# Altium project Modulo RF MK1.PrjPcb (part 1 of 2)
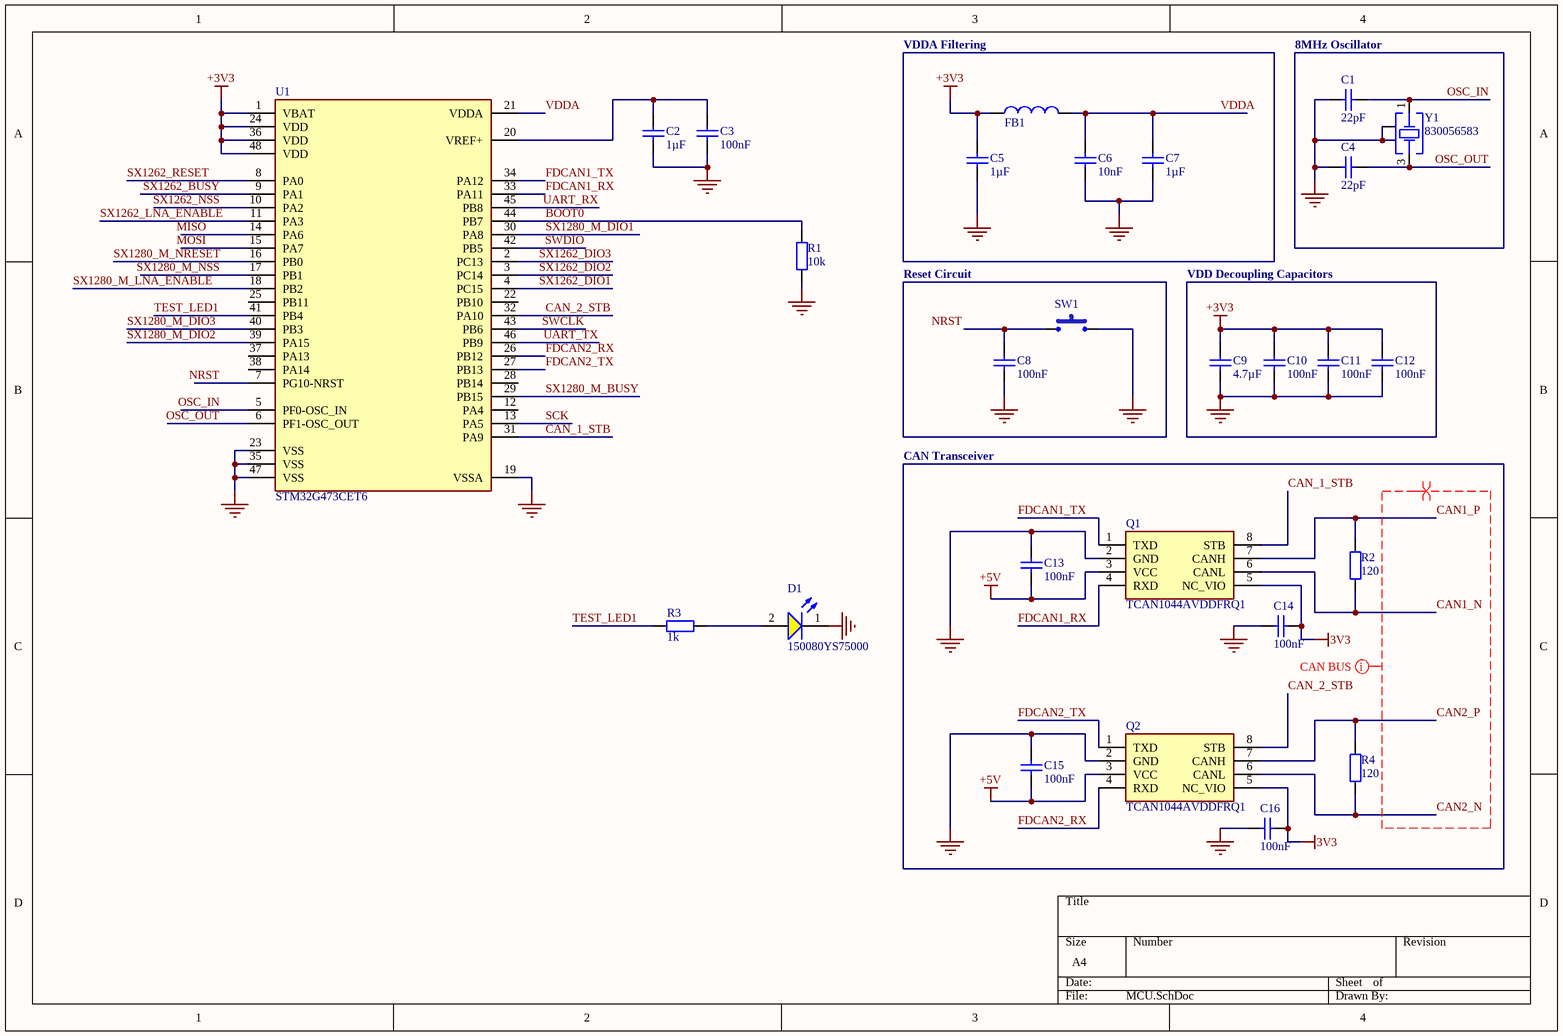
[diagram p0: MCU.SchDoc]
5 sheets, 138 parts. Net scope: global (net labels, ports and power ports of the same name join across sheets).
Board file: PCB_RF.PcbDoc
Sheets:
  MCU.SchDoc
  Connectors.SchDoc
  SX1280 MID VELOCITY.SchDoc
  SX1262.SchDoc
  Current and Voltage Measurement.SchDoc

## Sheet MCU.SchDoc
size A4; SheetNumber: 1; SheetTotal: 5; SPICEModelCacheSJGRFUCR: <root> / <DocumentId>SJGRFUCR</DocumentId> / <CacheFrame Number="0"> / <Model Name="0603_885012206071_100nf" Kind="CKT"> / <Text>******* / .subckt 0603_885012206071_100nF 1 2 / Rser 1 3 0.025 / Lser 2 4 0.0000000008 / C1 3 4 0.0000001 / Rpar 3 4 5000000000 / .ends 0603_885012206071_100nF</Text> / </Model> / <Model Name="0805_150080ys75000" Kind="CKT"> / <Text>****** / .subckt 0805_150080YS75000  1  2 / D1 1 2 SMCW / .MODEL SMCW D / + IS=10.000E-21 / + N=1.8000 / + RS=1.0003E-6 / + IKF=1.8092E-3 / + CJO=1.0000E-12 / + M=.3333 / + VJ=.75 / + BV=5 / + IBV=10.00E-6 / + TT=5.0000E-9 / .ends</Text> / </Model> / </CacheFrame> / </root>

### Parts
C1  value 22pF  [WCAP-CSGP_0603_L1.6W0.8H0.8_Reflow]  (hidden comment: 885012006034)
C2  value 1µF  [WCAP-CSGP_0603_L1.6W0.8H0.8_Reflow]  (hidden comment: 885012206052)
C3  value 100nF  [WCAP-CSGP_0603_L1.6W0.8H0.8_Reflow]  (hidden comment: 885012206071)
C4  value 22pF  [WCAP-CSGP_0603_L1.6W0.8H0.8_Reflow]  (hidden comment: 885012006034)
C5  value 1µF  [WCAP-CSGP_0603_L1.6W0.8H0.8_Reflow]  (hidden comment: 885012206052)
C6  value 10nF  [WCAP-CSGP_0603_L1.6W0.8H0.8_Reflow]  (hidden comment: 885012206065)
C7  value 1µF  [WCAP-CSGP_0603_L1.6W0.8H0.8_Reflow]  (hidden comment: 885012206052)
C8  value 100nF  [WCAP-CSGP_0603_L1.6W0.8H0.8_Reflow]  (hidden comment: 885012206071)
C9  value 4.7µF  [WCAP-CSGP_0603_L1.6W0.8H0.8_Reflow]  (hidden comment: 885012106012)
C10  value 100nF  [WCAP-CSGP_0603_L1.6W0.8H0.8_Reflow]  (hidden comment: 885012206071)
C11  value 100nF  [WCAP-CSGP_0603_L1.6W0.8H0.8_Reflow]  (hidden comment: 885012206071)
C12  value 100nF  [WCAP-CSGP_0603_L1.6W0.8H0.8_Reflow]  (hidden comment: 885012206071)
C13  value 100nF  [WCAP-CSGP_0603_L1.6W0.8H0.8_Reflow]  (hidden comment: 885012206071)
C14  value 100nF  [WCAP-CSGP_0603_L1.6W0.8H0.8_Reflow]  (hidden comment: 885012206071)
C15  value 100nF  [WCAP-CSGP_0603_L1.6W0.8H0.8_Reflow]  (hidden comment: 885012206071)
C16  value 100nF  [WCAP-CSGP_0603_L1.6W0.8H0.8_Reflow]  (hidden comment: 885012206071)
D1  150080YS75000  [WL-SMCW_0805_150080xx75000]
FB1  742792625  [WE-CBF_0603_L1.6W0.8H0.8_HC]  (value not drawn)
Q1  TCAN1044AVDDFRQ1  [FP-DDF0008A-MFG]
Q2  TCAN1044AVDDFRQ1  [FP-DDF0008A-MFG]
R1  value 10k  [WRIS-RSKS_0603_Reflow]  (hidden comment: 560112116005)
R2  value 120  [RCS0805120RFKEA-Footprint-1]  (hidden comment: RCS0805120RFKEA)
R3  value 1k  [WRIS-RSKS_0603_Reflow]  (hidden comment: 560112116014)
R4  value 120  [RCS0805120RFKEA-Footprint-1]  (hidden comment: RCS0805120RFKEA)
SW1  PTS815SJM250SMTRLFS  [PTS815SJM250SMTRLFS-Footprint-1]  (value not drawn)
U1  STM32G473CET6  [STM32G0C1RET6-Footprint-1]
Y1  830056583  [WE-XTAL_CFPX-104]

### Blocks framed on the sheet
VDDA Filtering: C5-C7 FB1
8MHz Oscillator: C1 C4 Y1
Reset Circuit: C8 SW1
VDD Decoupling Capacitors: C9-C12
CAN Transceiver: C13-C16 Q1 Q2 R2 R4

### Nets
+3V3: C5.2 C9.2 C10.2 C11.2 C12.2 C14.1 C16.1 FB1.1 Q1.5(NC_VIO) Q2.5(NC_VIO) U1.1(VBAT) U1.24(VDD) U1.36(VDD) U1.48(VDD)  [also labelled 3V3]  [project net 3V3_Current-]
+5V: C13.1 C15.1 Q1.3(VCC) Q2.3(VCC)  [project net 5V_Current-]
GND: C1.2 C2.1 C3.1 C4.2 C5.1 C6.1 C7.1 C8.1 C9.1 C10.1 C11.1 C12.1 C13.2 C14.2 C15.2 C16.2 D1.1(K) Q1.2(GND) Q2.2(GND) R1.1 SW1.2 U1.19(VSSA) U1.23(VSS) U1.35(VSS) U1.47(VSS) Y1.2(GND_&_Lid) Y1.4(GND_&_Lid)
BOOT0: R1.2 U1.44(PB7)
CAN1_N: Q1.6(CANL) R2.1
CAN1_P: Q1.7(CANH) R2.2
CAN2_N: Q2.6(CANL) R4.1
CAN2_P: Q2.7(CANH) R4.2
CAN_1_STB: Q1.8(STB) U1.31(PA9)
CAN_2_STB: Q2.8(STB) U1.32(PA10)
FDCAN1_RX: Q1.4(RXD) U1.33(PA11)
FDCAN1_TX: Q1.1(TXD) U1.34(PA12)
FDCAN2_RX: Q2.4(RXD) U1.26(PB12)
FDCAN2_TX: Q2.1(TXD) U1.27(PB13)
MISO: U1.14(PA6)
MOSI: U1.15(PA7)
NRST: C8.2 SW1.1 U1.7(PG10-NRST)
OSC_IN: C1.1 U1.5(PF0-OSC_IN) Y1.1(Crystal)
OSC_OUT: C4.1 U1.6(PF1-OSC_OUT) Y1.3(Crystal)
SCK: U1.13(PA5)
SWCLK: U1.43(PB6)
SWDIO: U1.42(PB5)
SX1262_BUSY: U1.9(PA1)
SX1262_DIO1: U1.4(PC15)
SX1262_DIO2: U1.3(PC14)
SX1262_DIO3: U1.2(PC13)
SX1262_LNA_ENABLE: U1.11(PA3)
SX1262_NSS: U1.10(PA2)
SX1262_RESET: U1.8(PA0)
SX1280_M_BUSY: U1.29(PB15)
SX1280_M_DIO1: U1.30(PA8)
SX1280_M_DIO2: U1.39(PA15)
SX1280_M_DIO3: U1.40(PB3)
SX1280_M_LNA_ENABLE: U1.18(PB2)
SX1280_M_NRESET: U1.16(PB0)
SX1280_M_NSS: U1.17(PB1)
TEST_LED1: R3.2 U1.41(PB4)
UART_RX: U1.45(PB8)
UART_TX: U1.46(PB9)
VDDA: C6.2 C7.2 FB1.2 U1.21(VDDA)
NetC2_2: C2.2 C3.2 U1.20(VREF+)
NetD1_2: D1.2(A) R3.1

Not connected (* = marked no-connect by the designer): U1 12(PA4) 22(PB10) 25(PB11) 28(PB14) 37(PA13) 38(PA14)

### Layout directives
net class CAN BUS: CAN1_N, CAN1_P, CAN2_N, CAN2_P
differential pair; net class CAN BUS; net class *; differential pair class CAN BUS: CAN1_N, CAN1_P, CAN2_N, CAN2_P

### Library data of the parts
C1 C4 = CMP-001-00150-1: WCAP-CSGP Multilayer Ceramic Chip Capacitor, General Purpose, size 0603, NP0, 22pF, 25VDC; Manufacturer: Wurth Elektronik; Q Factor: 840; Capacitance Tolerance: +/-5%; Insulation Resistance: 10GOhm; Technical Reference: NP00603220J025DFCT10000; Rated Voltage (DC): 25V; Category: Multilayer Ceramic Chip Capacitors; ComponentLink2URL: https://www.we-online.com/redexpert/spec/885012006034?ad; ComponentLink1Description: Website Link; Operating Temperature Max: 125°C; Ceramic Type: NP0; Operating Temperature Min: -55°C; Case/Package: 0603; Component Type: Standard; Width: 0.8mm; Source: WCAP-CSGP.SchLib; Pins: 2; Packaging: Tape and Reel; Mount: Surface Mount; ComponentLink2Description: Datasheet Link; ComponentLink1URL: https://www.we-online.com/redexpert/article/885012006034?ad; Manufacturer Part Number: 885012006034; Match Code: WCAP-CSGP; Design Item ID: 885012006034; Length: 1.6mm; Height: 0.8mm
C2 C5 C7 = CMP-001-00642-1: WCAP-CSGP Multilayer Ceramic Chip Capacitor, General Purpose, size 0603, X7R, 1uF, 16VDC; Manufacturer: Wurth Elektronik; Capacitance Tolerance: +/-10%; Insulation Resistance: 0.1GOhm; Rated Voltage (DC): 16V; Dissipation Factor: 10%; Technical Reference: X7R0603105K016DFCT10000; Component Type: Standard; Width: 0.8mm; Ceramic Type: X7R; ComponentLink1Description: Website Link; ComponentLink1URL: https://www.we-online.com/redexpert/article/885012206052?ad; Height: 0.8mm; Manufacturer Part Number: 885012206052; Match Code: WCAP-CSGP; Source: WCAP-CSGP.SchLib; Case/Package: 0603; Operating Temperature Min: -55°C; ComponentLink2Description: Datasheet Link; Design Item ID: 885012206052; ComponentLink2URL: https://www.we-online.com/redexpert/spec/885012206052?ad; Category: Multilayer Ceramic Chip Capacitors; Packaging: Tape and Reel; Pins: 2; Length: 1.6mm; Operating Temperature Max: 125°C; Mount: Surface Mount
C3 C8 C10-C16 = CMP-001-00661-1: WCAP-CSGP Multilayer Ceramic Chip Capacitor, General Purpose, size 0603, X7R, 100nF, 25VDC; Manufacturer: Wurth Elektronik; Dissipation Factor: 3.5%; Capacitance Tolerance: +/-10%; Insulation Resistance: 5GOhm; Technical Reference: X7R0603104K025DFCT10000; Rated Voltage (DC): 25V; Packaging: Tape and Reel; Height: 0.8mm; Mount: Surface Mount; Source: WCAP-CSGP.SchLib; Component Type: Standard; Category: Multilayer Ceramic Chip Capacitors; Operating Temperature Min: -55°C; Case/Package: 0603; ComponentLink2Description: Datasheet Link; Width: 0.8mm; ComponentLink1URL: https://www.we-online.com/redexpert/article/885012206071?ad; Length: 1.6mm; Operating Temperature Max: 125°C; Match Code: WCAP-CSGP; ComponentLink2URL: https://www.we-online.com/redexpert/spec/885012206071?ad; Design Item ID: 885012206071; ComponentLink1Description: Website Link; Manufacturer Part Number: 885012206071; Pins: 2; Ceramic Type: X7R
C6 = CMP-001-00655-1: WCAP-CSGP Multilayer Ceramic Chip Capacitor, General Purpose, size 0603, X7R, 10nF, 25VDC; Manufacturer: Wurth Elektronik; Dissipation Factor: 3.5%; Technical Reference: X7R0603103K025DFCT10000; Capacitance Tolerance: +/-10%; Insulation Resistance: 10GOhm; Rated Voltage (DC): 25V; ComponentLink1Description: Website Link; Packaging: Tape and Reel; Match Code: WCAP-CSGP; Ceramic Type: X7R; ComponentLink1URL: https://www.we-online.com/redexpert/article/885012206065?ad; ComponentLink2URL: https://www.we-online.com/redexpert/spec/885012206065?ad; Component Type: Standard; Case/Package: 0603; Operating Temperature Min: -55°C; ComponentLink2Description: Datasheet Link; Category: Multilayer Ceramic Chip Capacitors; Pins: 2; Mount: Surface Mount; Height: 0.8mm; Source: WCAP-CSGP.SchLib; Length: 1.6mm; Design Item ID: 885012206065; Operating Temperature Max: 125°C; Width: 0.8mm; Manufacturer Part Number: 885012206065
C9 = CMP-001-00440-1: WCAP-CSGP Multilayer Ceramic Chip Capacitor, General Purpose, size 0603, X5R, 4.7uF, 10VDC; Manufacturer: Wurth Elektronik; Rated Voltage (DC): 10V; Technical Reference: X5R0603475M010DFCT10000; Dissipation Factor: 10%; Insulation Resistance: 0.02GOhm; Capacitance Tolerance: +/-20%; ComponentLink2URL: https://www.we-online.com/redexpert/spec/885012106012?ad; Height: 0.8mm; Packaging: Tape and Reel; Case/Package: 0603; Manufacturer Part Number: 885012106012; Component Type: Standard; Width: 0.8mm; Match Code: WCAP-CSGP; Mount: Surface Mount; Ceramic Type: X5R; Operating Temperature Max: 85°C; ComponentLink1Description: Website Link; Length: 1.6mm; ComponentLink1URL: https://www.we-online.com/redexpert/article/885012106012?ad; ComponentLink2Description: Datasheet Link; Category: Multilayer Ceramic Chip Capacitors; Source: WCAP-CSGP.SchLib; Operating Temperature Min: -55°C; Pins: 2; Design Item ID: 885012106012
D1 = CMP-004-00456-1: WL-SMCW Mono-color Chip LED Waterclear, SMT, size 0805, Yellow, 2V, 140°; Manufacturer: Wurth Elektronik; Chip Technology: AlInGaP; Peak Wavelength: 595nm; Luminous Intensity: 120mcd; Dominant Wavelength: 590nm; ComponentLink1URL: https://www.we-online.com/redexpert/article/150080YS75000?ad; Match Code: WL-SMCW; Design Item ID: 150080YS75000; ComponentLink2Description: Datasheet Link; Mount: Surface Mount; Emitting Color: Yellow; Pins: 2; Case/Package: 0805; Viewing Angle: 140°; Packaging: Tape and Reel; Width: 1.25mm; ComponentLink2URL: https://www.we-online.com/redexpert/spec/150080YS75000?ad; Length: 2mm; Forward Voltage: 2V; Source: WL-SMCW.SchLib; Operating Temperature Max: 85°C; Manufacturer Part Number: 150080YS75000; Component Type: Standard; Operating Temperature Min: -40°C; ComponentLink1Description: Website Link; Category: Signal LEDs; Height: 0.7mm
FB1 = CMP-006-00120-1: WE-CBF SMT EMI Suppression Ferrite Bead, size 0603, 120Ohm, 2A; Manufacturer: Wurth Elektronik; Impedance Max: 180Ohm; Type: High Current; Impedance Max Test Condition: 400MHz; DC Resistance Max: 0.05Ohm; Length: 1.6mm; Mount: Surface Mount; Source: WE-CBF.SchLib; ComponentLink2Description: Datasheet Link; Match Code: WE-CBF; Height: 0.8mm; Pins: 2; Manufacturer Part Number: 742792625; ComponentLink1Description: Website Link; Component Type: Standard; Packaging: Tape and Reel; Design Item ID: 742792625; Operating Temperature Max: 125°C; Operating Temperature Min: -55°C; Rated Current: 2A; ComponentLink1URL: https://www.we-online.com/redexpert/article/742792625?ad; Category: Ferrites for PCB Assembly; ComponentLink2URL: https://www.we-online.com/redexpert/spec/742792625?ad; Case/Package: 0603; Width: 0.8mm; Impedance @100MHz: 120Ohm
Q1 Q2 = CMP-015-00003-4: Enhanced automotive CAN transceiver with standby 8-SOT-23-THIN -40 to 150
R1 = CMP-009-00328-1: WRIS-RSKS Thick Film Resistor, size 0603, 10000Ohm, 100mW; Manufacturer: Wurth Elektronik; Limiting Element Voltage: 75V; Temperature Coefficient of Resistance Max: 100ppm/°C; Resistance Tolerance: +/-1%; Temperature Coefficient of Resistance Min: -100ppm/°C; ComponentLink1Description: Website Link; Case/Package: 0603; Pins: 2; Match Code: WRIS-RSKS; Operating Temperature Max: 155°C; Width: 0.8mm; Design Item ID: 560112116005; Length: 1.6mm; ComponentLink2Description: Datasheet Link; ComponentLink2URL: https://www.we-online.com/redexpert/spec/560112116005?ad; Packaging: Tape and Reel; Source: WRIS-RSKS.SchLib; Height: 0.45mm; Manufacturer Part Number: 560112116005; Component Type: Standard; Mount: Surface Mount; Operating Temperature Min: -55°C; Rated Power: 100mW; ComponentLink1URL: https://www.we-online.com/redexpert/article/560112116005?ad; Category: Thick Film Resistors
R2 R4 = CMP-009-00119-3: Fixed Resistor, Metal Glaze/thick Film, 0.4W, 120ohm, 150V, 1% +/-Tol, 100ppm/Cel, Surface Mount, 0805; Power: 500mW; Case/Package: 0805; Mounting Technology: SMD; Pins: 2
R3 = CMP-009-00337-1: WRIS-RSKS Thick Film Resistor, size 0603, 1000Ohm, 100mW; Manufacturer: Wurth Elektronik; Resistance Tolerance: +/-1%; Limiting Element Voltage: 75V; Temperature Coefficient of Resistance Min: -100ppm/°C; Temperature Coefficient of Resistance Max: 100ppm/°C; Mount: Surface Mount; Rated Power: 100mW; Packaging: Tape and Reel; Case/Package: 0603; ComponentLink1URL: https://www.we-online.com/redexpert/article/560112116014?ad; Height: 0.45mm; Manufacturer Part Number: 560112116014; ComponentLink1Description: Website Link; ComponentLink2URL: https://www.we-online.com/redexpert/spec/560112116014?ad; Source: WRIS-RSKS.SchLib; Operating Temperature Min: -55°C; Width: 0.8mm; Match Code: WRIS-RSKS; Design Item ID: 560112116014; ComponentLink2Description: Datasheet Link; Category: Thick Film Resistors; Operating Temperature Max: 155°C; Component Type: Standard; Length: 1.6mm; Pins: 2
SW1 = CMP-011-00002-1: Keypad Switch, 1 Switches, SPST, Momentary-tactile, 0.05A, 12VDC, 2.26N, Solder Terminal, Surface Mount-straight
U1 = CMP-020-00001-7: Microcontroladores ARM (MCU) Mainstream Arm Cortex-M4+ MCU 170MHz 512Kbytes Math Accelerator High Analog
Y1 = CMP-003-00170-1: WE-XTAL Quartz Crystal, SMT, CFPX-104, 10MHz, +/-30ppm; Manufacturer: Wurth Elektronik; Load Capacitance: 12pF; Component Type: Standard; Operating Temperature Min: -40°C; Pins: 4; ComponentLink2URL: https://www.we-online.com/redexpert/spec/830056583?ad; Frequency Tolerance: +/-30ppm; Packaging: Tape and Reel; Match Code: WE-XTAL; Frequency Stability: +/-30ppm; ComponentLink1URL: https://www.we-online.com/redexpert/article/830056583?ad; Mount: Surface Mount; ComponentLink1Description: Website Link; Source: WE-XTAL.SchLib; Length: 5mm; Manufacturer Part Number: 830056583; Width: 3.2mm; Design Item ID: 830056583; Height: 1mm; Frequency: 10MHz; Operating Temperature Max: 85°C; Case/Package: CFPX-104; ComponentLink2Description: Datasheet Link; Category: Crystals

## Sheet Connectors.SchDoc
size A4; SheetNumber: 2; SheetTotal: 5; SPICEModelCacheIIVRYWVE: <root> / <DocumentId>IIVRYWVE</DocumentId> / <CacheFrame Number="0"> / <Model Name="0805_150080gs75000" Kind="CKT"> / <Text>****** / .subckt 0805_150080GS75000  1  2 / D1 1 2 SMCW / .MODEL SMCW D / + IS=906.98E-12 / + N=4.4982 / + RS=1.5743 / + IKF=518.93E-9 / + CJO=1.0000E-12 / + M=.3333 / + VJ=.75 / + BV=5 / + IBV=10.00E-6 / + TT=5.0000E-9 / .ends</Text> / </Model> / </CacheFrame> / </root>
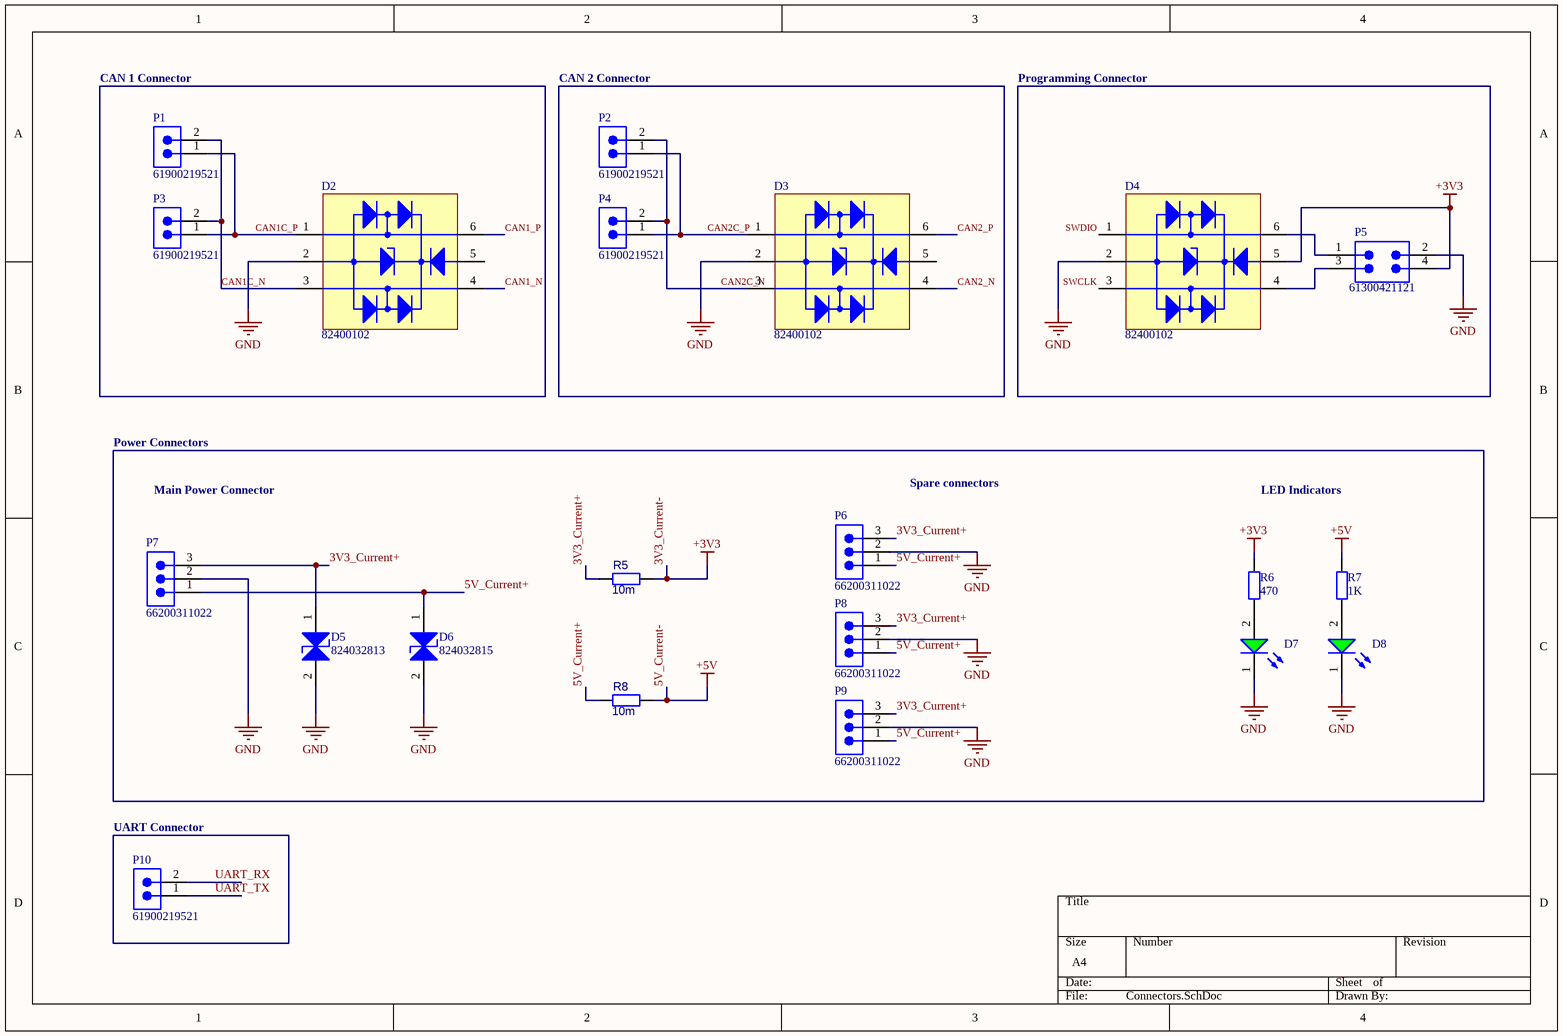
[diagram p1: Connectors.SchDoc]

### Parts
D2  82400102  [WE-TVS_SOT23-6L]
D3  82400102  [WE-TVS_SOT23-6L]
D4  82400102  [WE-TVS_SOT23-6L]
D5  824032813  [WE-TVS_DFN1610-2L]
D6  824032815  [WE-TVS_DFN1610-2L]
D7  150080GS75000  [WL-SMCW_0805_150080xx75000]  (value not drawn)
D8  150080GS75000  [WL-SMCW_0805_150080xx75000]  (value not drawn)
P1  61900219521  [61900219521]
P2  61900219521  [61900219521]
P3  61900219521  [61900219521]
P4  61900219521  [61900219521]
P5  61300421121  [61300421121]
P6  66200311022  [66200311022]
P7  66200311022  [66200311022]
P8  66200311022  [66200311022]
P9  66200311022  [66200311022]
P10  61900219521  [61900219521]
R5  10m  [580070763010-Footprint-1]
R6  value 470  [WRIS-RSKS_0603_Reflow]  (hidden comment: 560112116067)
R7  value 1K  [WRIS-RSKS_0603_Reflow]  (hidden comment: 560112116014)
R8  10m  [580070763010-Footprint-1]

### Blocks framed on the sheet
CAN 1 Connector: D2 P1 P3
CAN 2 Connector: D3 P2 P4
Programming Connector: D4 P5
UART Connector: P10

### Nets
3V3_Current-: D4.5(VDD) P5.4 R5.2 R6.2  [also labelled +3V3]
5V_Current-: R7.2 R8.2  [also labelled +5V]
GND: D2.2(GND) D3.2(GND) D4.2(GND) D5.2(GND) D6.2(GND) D7.1(K) D8.1(K) P5.2 P6.2 P7.2 P8.2 P9.2
3V3_Current+: D5.1(I/O_1) P6.3 P7.3 P8.3 P9.3 R5.1
5V_Current+: D6.1(I/O_1) P6.1 P7.1 P8.1 P9.1 R8.1
CAN1_N: D2.4(I/O_2)
CAN1_P: D2.6(I/O_1)
CAN1C_N: D2.3(I/O_2) P1.2 P3.2
CAN1C_P: D2.1(I/O_1) P1.1 P3.1
CAN2_N: D3.4(I/O_2)
CAN2_P: D3.6(I/O_1)
CAN2C_N: D3.3(I/O_2) P2.2 P4.2
CAN2C_P: D3.1(I/O_1) P2.1 P4.1
SWCLK: D4.3(I/O_2)
SWDIO: D4.1(I/O_1)
UART_RX: P10.2
UART_TX: P10.1
NetD4_4: D4.4(I/O_2) P5.3
NetD4_6: D4.6(I/O_1) P5.1
NetD7_2: D7.2(A) R6.1
NetD8_2: D8.2(A) R7.1

Not connected (* = marked no-connect by the designer): D2 5(VDD); D3 5(VDD)

### Notes on the sheet
- Power Connectors
- Main Power Connector
- Spare connectors
- LED Indicators

### Library data of the parts
D2-D4 = CMP-004-00017-1: WE-TVS TVS Diode – High Speed Series, SOT23-6L, 2+1 Channel, 5V, 2pF; Manufacturer: Wurth Elektronik; Polarity: Unidirectional; Channel ESD Clamping Voltage: 10V; ESD Air Discharge Capability: 15kV; (Reverse) Peak Pulse Current: 7A; (Reverse) Breakdown Voltage: 6V; Channel Reverse Leakage Current: 1uA; ESD Contact Discharge Capability: 8kV; Source: WE-TVS.SchLib; Component Type: Standard; Packaging: Tape and Reel; Height: 1.45mm; Pins: 6; Match Code: WE-TVS; Case/Package: SOT23-6L; Mount: Surface Mount; Channel Operating Voltage: 5V; ComponentLink1Description: Website Link; ComponentLink2URL: https://www.we-online.com/redexpert/spec/82400102?ad; Category: ESD Protection; Channel Input Capacitance: 2pF; Operating Temperature Min: -40°C; ComponentLink1URL: https://www.we-online.com/redexpert/article/82400102?ad; Length: 2.9mm; Width: 2.8mm; Manufacturer Part Number: 82400102; Design Item ID: 82400102; ComponentLink2Description: Datasheet Link; Operating Temperature Max: 125°C; Number of Channels: 2+1
D5 = CMP-03913-133963840-1: 824032813 Tvs Diode, Bidir, 3.3V, Dfn1610 Rohs Compliant: Yes; Width: 1mm; NexarPartId: 133963840; Min Operating Temperature: -55°C; Max Operating Temperature: 125°C; Height: 500µm; Length: 1.6mm; RoHS: Compliant
D6 = CMP-03913-133963841-1: 824032815 Tvs Diode, Bidir, 5V, Dfn1610 Rohs Compliant: Yes; Min Operating Temperature: -55°C; Width: 1mm; NexarPartId: 133963841; Length: 1.6mm; RoHS: Compliant; Max Operating Temperature: 85°C; Height: 500µm
D7 D8 = CMP-004-00452-1: WL-SMCW Mono-color Chip LED Waterclear, SMT, size 0805, Green, 3.2V, 140°; Manufacturer: Wurth Elektronik; Dominant Wavelength: 525nm; Chip Technology: InGaN; Luminous Intensity: 450mcd; Peak Wavelength: 515nm; Viewing Angle: 140°; Source: WL-SMCW.SchLib; Category: Signal LEDs; Design Item ID: 150080GS75000; ComponentLink1URL: https://www.we-online.com/redexpert/article/150080GS75000?ad; Pins: 2; Emitting Color: Green; Mount: Surface Mount; ComponentLink2URL: https://www.we-online.com/redexpert/spec/150080GS75000?ad; Match Code: WL-SMCW; ComponentLink1Description: Website Link; Operating Temperature Max: 85°C; Case/Package: 0805; Manufacturer Part Number: 150080GS75000; Forward Voltage: 3.2V; Operating Temperature Min: -40°C; Component Type: Standard; Height: 0.7mm; Length: 2mm; Width: 1.25mm; Packaging: Tape and Reel; ComponentLink2Description: Datasheet Link
P1-P4 P10 = CMP-002-00288-1: WR-WTB THT Male Right Angled Top Locking Header, pitch 2.54mm, 2pins; Manufacturer: Wurth Elektronik; Working Voltage: 250VAC; Contact Resistance: 20mOhm; Rated Current: 3A; Withstanding Voltage: 1000VAC; Number of Rows: 1; Length: 5.08mm; ComponentLink1URL: https://www.we-online.com/redexpert/article/61900219521?ad; Mount: Through Hole; ComponentLink2Description: Datasheet Link; Pins: 2; Width: 12.47mm; Height: 5.8mm; Component Type: Standard; Orientation: Right Angled Top Locking; Match Code: WR-WTB; Design Item ID: 61900219521; Pitch: 2.54mm; ComponentLink2URL: https://www.we-online.com/redexpert/spec/61900219521?ad; Manufacturer Part Number: 61900219521; ComponentLink1Description: Website Link; Packaging: Bag; Gender: Male; Pin Count: 2; Operating Temperature Max: 105°C; Source: WR-WTB.SchLib; Category: Wire-to-Board Connectors; Operating Temperature Min: -40°C
P5 = CMP-002-00747-2: Board Connector, 4 Contact(s), 2 Row(s), Male, Straight, 0.1 inch Pitch, Solder Terminal, Black Insulator, Plug; RoHS Compliant: Yes; Min Operating Temperature: -40°C; Mounting Technology: Board; Connector Type: BOARD CONNECTOR; Max Operating Temperature: 125°C
P6-P9 = CMP-1502-00462-2: NexarPartId: 29930352; Insulation Resistance: 1GΩ; Operating Supply Voltage: 250V; Current Rating: 5A; Pitch: 3mm; Contact Resistance: 10mΩ; Gender: Male; Length: 12.65mm; Number of Pins: 3; Max Operating Temperature: 105°C; Min Operating Temperature: -40°C; Lead Pitch: 3mm; RoHS: Compliant; Contact Plating: Tin
R5 R8 = CMP-009-00124-2: Res, 0R01, 1%, 2W, Metal Foil, 0612 Rohs Compliant: Yes
R6 = CMP-009-00390-1: WRIS-RSKS Thick Film Resistor, size 0603, 470Ohm, 100mW; Manufacturer: Wurth Elektronik; Limiting Element Voltage: 75V; Temperature Coefficient of Resistance Max: 100ppm/°C; Resistance Tolerance: +/-1%; Temperature Coefficient of Resistance Min: -100ppm/°C; Rated Power: 100mW; Height: 0.45mm; ComponentLink2Description: Datasheet Link; Component Type: Standard; ComponentLink1URL: https://www.we-online.com/redexpert/article/560112116067?ad; ComponentLink1Description: Website Link; Operating Temperature Min: -55°C; Match Code: WRIS-RSKS; Mount: Surface Mount; Case/Package: 0603; Source: WRIS-RSKS.SchLib; Length: 1.6mm; Category: Thick Film Resistors; Operating Temperature Max: 155°C; Pins: 2; Packaging: Tape and Reel; Manufacturer Part Number: 560112116067; ComponentLink2URL: https://www.we-online.com/redexpert/spec/560112116067?ad; Width: 0.8mm; Design Item ID: 560112116067
R7 = CMP-009-00337-1: as R3 on sheet MCU; Mount: Surface Mount; Rated Power: 100mW; Packaging: Tape and Reel; Case/Package: 0603; ComponentLink1URL: https://www.we-online.com/redexpert/article/560112116014?ad; Height: 0.45mm; Manufacturer Part Number: 560112116014; ComponentLink1Description: Website Link; ComponentLink2URL: https://www.we-online.com/redexpert/spec/560112116014?ad; Source: WRIS-RSKS.SchLib; Operating Temperature Min: -55°C; Width: 0.8mm; Match Code: WRIS-RSKS; Design Item ID: 560112116014; ComponentLink2Description: Datasheet Link; Category: Thick Film Resistors; Operating Temperature Max: 155°C; Component Type: Standard; Length: 1.6mm; Pins: 2

## Sheet SX1280 MID VELOCITY.SchDoc
size A4; SheetNumber: 3; SheetTotal: 5; SPICEModelCacheBULOLAEW: <root> / <DocumentId>BULOLAEW</DocumentId> / <CacheFrame Number="0"> / <Model Name="0603_885012206065_10nf" Kind="CKT"> / <Text>******* / .subckt 0603_885012206065_10nF 1 2 / Rser 1 3 0.05893 / Lser 2 4 0.00000000037916 / C1 3 4 0.00000001 / Rpar 3 4 10000000000 / .ends 0603_885012206065_10nF</Text> / </Model> / <Model Name="0603_885012206071_100nf" Kind="CKT"> / <Text>******* / .subckt 0603_885012206071_100nF 1 2 / Rser 1 3 0.025 / Lser 2 4 0.0000000008 / C1 3 4 0.0000001 / Rpar 3 4 5000000000 / .ends 0603_885012206071_100nF</Text> / </Model> / <Model Name="0603_885012206050_470nf" Kind="CKT"> / <Text>******* / .subckt 0603_885012206050_470nF 1 2 / Rser 1 3 0.00930503966198 / Lser 2 4 4.27988831E-10 / C1 3 4 0.00000047 / Rpar 3 4 1100000000 / .ends 0603_885012206050_470nF</Text> / </Model> / <Model Name="0603_885012006036_47pf" Kind="CKT"> / <Text>******* / .subckt 0603_885012006036_47pF 1 2 / Rser 1 3 0.062255914612 / Lser 2 4 4.24328623E-10 / C1 3 4 0.000000000047 / Rpar 3 4 10000000000 / .ends 0603_885012006036_47pF</Text> / </Model> / <Model Name="0603_885012106012_4.7uf" Kind="CKT"> / <Text>******* / .subckt 0603_885012106012_4.7uF 1 2 / Rser 1 3 0.00455496693599 / Lser 2 4 5.03384516E-10 / C1 3 4 0.0000047 / Rpar 3 4 20000000 / .ends 0603_885012106012_4.7uF</Text> / </Model> / <Model Name="0603_885012206052_1uf" Kind="CKT"> / <Text>******* / .subckt 0603_885012206052_1uF 1 2 / Rser 1 3 0.00742821402486 / Lser 2 4 2.51142993E-10 / C1 3 4 0.000001 / Rpar 3 4 100000000 / .ends 0603_885012206052_1uF</Text> / </Model> / <Model Name="0603_885012006057_100pf" Kind="CKT"> / <Text>******* / .subckt 0603_885012006057_100pF 1 2 / Rser 1 3 0.155626039874 / Lser 2 4 4.37579661E-10 / C1 3 4 0.0000000001 / Rpar 3 4 10000000000 / .ends 0603_885012006057_100pF</Text> / </Model> / </CacheFrame> / </root>
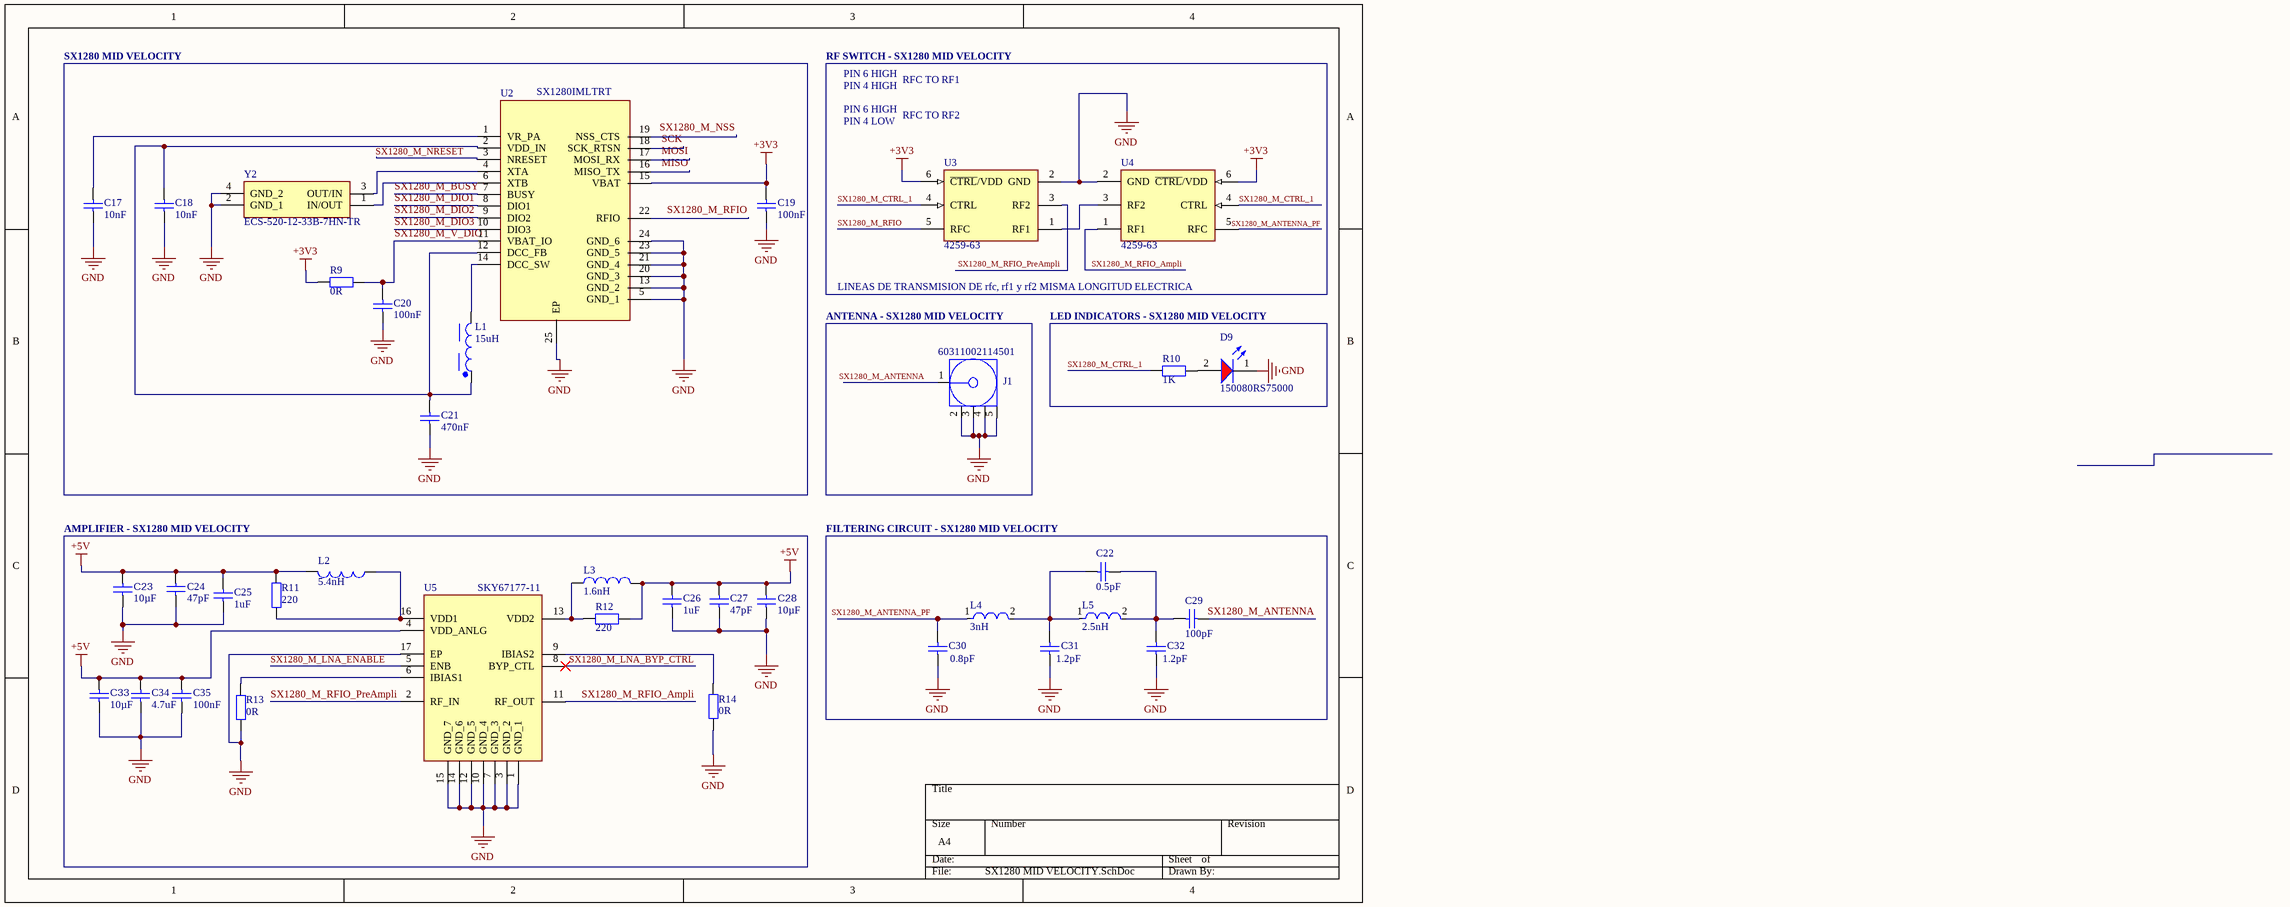
[diagram p2: SX1280 MID VELOCITY.SchDoc]

### Parts
C17  value 10nF  [WCAP-CSGP_0603_L1.6W0.8H0.8_Reflow]  (hidden comment: 885012206065)
C18  value 10nF  [WCAP-CSGP_0603_L1.6W0.8H0.8_Reflow]  (hidden comment: 885012206065)
C19  value 100nF  [WCAP-CSGP_0603_L1.6W0.8H0.8_Reflow]  (hidden comment: 885012206071)
C20  value 100nF  [WCAP-CSGP_0603_L1.6W0.8H0.8_Reflow]  (hidden comment: 885012206071)
C21  value 470nF  [WCAP-CSGP_0603_L1.6W0.8H0.8_Reflow]  (hidden comment: 885012206050)
C22  value 0.5pF  [WCAP-CSGP_0603_L1.6W0.8H0.8_Reflow]  (hidden comment: 885012006086)
C23  value 10µF  [GRM21BR61E106KA73K-Footprint-1]  (hidden comment: GRM21BR61E106KA73K)
C24  value 47pF  [WCAP-CSGP_0603_L1.6W0.8H0.8_Reflow]  (hidden comment: 885012006036)
C25  value 1uF  [WCAP-CSGP_0603_L1.6W0.8H0.8_Reflow]  (hidden comment: 885012206052)
C26  value 1uF  [WCAP-CSGP_0603_L1.6W0.8H0.8_Reflow]  (hidden comment: 885012206052)
C27  value 47pF  [WCAP-CSGP_0603_L1.6W0.8H0.8_Reflow]  (hidden comment: 885012006036)
C28  value 10µF  [GRM21BR61E106KA73K-Footprint-1]  (hidden comment: GRM21BR61E106KA73K)
C29  value 100pF  [WCAP-CSGP_0603_L1.6W0.8H0.8_Reflow]  (hidden comment: 885012006057)
C30  0.8pF  [WCAP-CSGP_0603_L1.6W0.8H0.8_Reflow]
C31  1.2pF  [WCAP-CSGP_0603_L1.6W0.8H0.8_Reflow]
C32  1.2pF  [WCAP-CSGP_0603_L1.6W0.8H0.8_Reflow]
C33  value 10µF  [GRM21BR61E106KA73K-Footprint-1]  (hidden comment: GRM21BR61E106KA73K)
C34  value 4.7uF  [WCAP-CSGP_0603_L1.6W0.8H0.8_Reflow]  (hidden comment: 885012106012)
C35  value 100nF  [WCAP-CSGP_0603_L1.6W0.8H0.8_Reflow]  (hidden comment: 885012206071)
D9  150080RS75000  [WL-SMCW_0805_150080xx75000]
J1  60311002114501  [60311002114501]
L1  Inductance: 15uH  [WE-LHCA_7030]  (hidden comment: 784373460150)
L2  5.4nH  [WE-KI_0603]
L3  1.6nH  [WE-KI_0603]
L4  3nH  [FP-LQW18AN_80-MFG]
L5  2.5nH  [FP-LQW18AN_80-MFG]
R9  0R  [WRIS-RSKS_0603_Reflow]
R10  value 1K  [WRIS-RSKS_0603_Reflow]  (hidden comment: 560112116014)
R11  value 220  [WRIS-RSKS_0603_Reflow]  (hidden comment: 560112116126)
R12  value 220  [WRIS-RSKS_0603_Reflow]  (hidden comment: 560112116126)
R13  0R  [WRIS-RSKS_0603_Reflow]
R14  0R  [WRIS-RSKS_0603_Reflow]
U2  SX1280IMLTRT  [SX1280IMLTRT-Footprint-1]
U3  4259-63  [PERE-SC-70-6_M]
U4  4259-63  [PERE-SC-70-6_M]
U5  SKY67177-11  [SKY67177-11-Footprint-1]
Y2  ECS-520-12-33B-7HN-TR  [ECS-520-12-33B-7HN-TR-Footprint-1]

### Blocks framed on the sheet
SX1280 MID VELOCITY: C17-C21 L1 R9 U2 Y2
ANTENNA - SX1280 MID VELOCITY: J1
LED INDICATORS - SX1280 MID VELOCITY: D9 R10
AMPLIFIER - SX1280 MID VELOCITY: C23-C28 C33-C35 L2 L3 R11-R14 U5
FILTERING CIRCUIT - SX1280 MID VELOCITY: C22 C29-C32 L4 L5

### Nets
+3V3: C19.2 R9.2 U2.15(VBAT) U3.6(~{CTRL}/VDD) U4.6(~{CTRL}/VDD)  [project net 3V3_Current-]
+5V: C23.2 C24.1 C25.2 C26.2 C27.1 C28.2 C33.2 C34.2 C35.2 L2.2 L3.2 R11.2 R12.2 U5.4(VDD_ANLG)  [project net 5V_Current-]
GND: C17.1 C18.1 C19.1 C20.1 C21.1 C23.1 C24.2 C25.1 C26.1 C27.2 C28.1 C30.1 C31.1 C32.1 C33.1 C34.1 C35.1 D9.1(K) J1.2(GND) J1.3(GND) J1.4(GND) J1.5(GND) R13.1 R14.1 U2.5(GND_1) U2.13(GND_2) U2.20(GND_3) U2.21(GND_4) U2.23(GND_5) U2.24(GND_6) U2.25(EP) U3.2(GND) U4.2(GND) U5.1(GND_1) U5.3(GND_2) U5.7(GND_3) U5.10(GND_4) U5.12(GND_5) U5.14(GND_6) U5.15(GND_7) U5.17(EP) Y2.2(GND_1) Y2.4(GND_2)
MISO: U2.16(MISO_TX)
MOSI: U2.17(MOSI_RX)
SCK: U2.18(SCK_RTSN)
SX1280_M_ANTENNA: C29.2 J1.1(Signal)
SX1280_M_ANTENNA_PF: C30.2 L4.1 U4.5(RFC)
SX1280_M_BUSY: U2.7(BUSY)
SX1280_M_CTRL_1: R10.1 U3.4(CTRL) U4.4(CTRL)
SX1280_M_DIO1: U2.8(DIO1)
SX1280_M_DIO2: U2.9(DIO2)
SX1280_M_DIO3: U2.10(DIO3)
SX1280_M_LNA_BYP_CTRL: U5.8(BYP_CTL)
SX1280_M_LNA_ENABLE: U5.5(ENB)
SX1280_M_NRESET: U2.3(NRESET)
SX1280_M_NSS: U2.19(NSS_CTS)
SX1280_M_RFIO: U2.22(RFIO) U3.5(RFC)
SX1280_M_RFIO_Ampli: U4.1(RF1) U5.11(RF_OUT)
SX1280_M_RFIO_PreAmpli: U3.3(RF2) U5.2(RF_IN)
SX1280_M_V_DIO: C20.2 R9.1 U2.11(VBAT_IO)
NetC17_2: C17.2 U2.1(VR_PA)
NetC18_2: C18.2 C21.2 L1.1 U2.2(VDD_IN) U2.12(DCC_FB)
NetC22_1: C22.1 C31.2 L4.2 L5.1
NetC22_2: C22.2 C29.1 C32.2 L5.2
NetD9_2: D9.2(A) R10.2
NetL1_2: L1.2 U2.14(DCC_SW)
NetL2_1: L2.1 R11.1 U5.16(VDD1)
NetL3_1: L3.1 R12.1 U5.13(VDD2)
NetR13_2: R13.2 U5.6(IBIAS1)
NetR14_2: R14.2 U5.9(IBIAS2)
NetU2_4: U2.4(XTA) Y2.3(OUT/IN)
NetU2_6: U2.6(XTB) Y2.1(IN/OUT)
NetU3_1: U3.1(RF1) U4.3(RF2)

### Notes on the sheet
- RF SWITCH - SX1280 MID VELOCITY
- PIN 6 HIGH
- PIN 4 HIGH
- RFC TO RF1
- PIN 4 LOW
- RFC TO RF2
- LINEAS DE TRANSMISION DE rfc, rf1 y rf2 MISMA LONGITUD ELECTRICA

### Library data of the parts
C17 C18 = CMP-001-00655-1: as C6 on sheet MCU; ComponentLink1Description: Website Link; Packaging: Tape and Reel; Match Code: WCAP-CSGP; Ceramic Type: X7R; ComponentLink1URL: https://www.we-online.com/redexpert/article/885012206065?ad; ComponentLink2URL: https://www.we-online.com/redexpert/spec/885012206065?ad; Component Type: Standard; Case/Package: 0603; Operating Temperature Min: -55°C; ComponentLink2Description: Datasheet Link; Category: Multilayer Ceramic Chip Capacitors; Pins: 2; Mount: Surface Mount; Height: 0.8mm; Source: WCAP-CSGP.SchLib; Length: 1.6mm; Design Item ID: 885012206065; Operating Temperature Max: 125°C; Width: 0.8mm; Manufacturer Part Number: 885012206065
C19 C20 C35 = CMP-001-00661-1: as C3 on sheet MCU; Packaging: Tape and Reel; Height: 0.8mm; Mount: Surface Mount; Source: WCAP-CSGP.SchLib; Component Type: Standard; Category: Multilayer Ceramic Chip Capacitors; Operating Temperature Min: -55°C; Case/Package: 0603; ComponentLink2Description: Datasheet Link; Width: 0.8mm; ComponentLink1URL: https://www.we-online.com/redexpert/article/885012206071?ad; Length: 1.6mm; Operating Temperature Max: 125°C; Match Code: WCAP-CSGP; ComponentLink2URL: https://www.we-online.com/redexpert/spec/885012206071?ad; Design Item ID: 885012206071; ComponentLink1Description: Website Link; Manufacturer Part Number: 885012206071; Pins: 2; Ceramic Type: X7R
C21 = CMP-001-00640-1: WCAP-CSGP Multilayer Ceramic Chip Capacitor, General Purpose, size 0603, X7R, 470nF, 16VDC; Manufacturer: Wurth Elektronik; Insulation Resistance: 1.1GOhm; Dissipation Factor: 5%; Rated Voltage (DC): 16V; Capacitance Tolerance: +/-10%; Technical Reference: X7R0603474K016DFCT10000; Operating Temperature Max: 125°C; Width: 0.8mm; ComponentLink2URL: https://www.we-online.com/redexpert/spec/885012206050?ad; Packaging: Tape and Reel; Mount: Surface Mount; Case/Package: 0603; Operating Temperature Min: -55°C; Manufacturer Part Number: 885012206050; Category: Multilayer Ceramic Chip Capacitors; Component Type: Standard; Ceramic Type: X7R; Design Item ID: 885012206050; Pins: 2; Height: 0.8mm; ComponentLink2Description: Datasheet Link; ComponentLink1URL: https://www.we-online.com/redexpert/article/885012206050?ad; Length: 1.6mm; Match Code: WCAP-CSGP; ComponentLink1Description: Website Link; Source: WCAP-CSGP.SchLib
C22 = CMP-001-00191-1: WCAP-CSGP Multilayer Ceramic Chip Capacitor, General Purpose, size 0603, NP0, 0.5pF, 100VDC; Manufacturer: Wurth Elektronik; Technical Reference: NP00603R50C100DFCT10000; Capacitance Tolerance: +/-0.25pF; Rated Voltage (DC): 100V; Insulation Resistance: 10GOhm; Q Factor: 410; Height: 0.8mm; Packaging: Tape and Reel; ComponentLink2URL: https://www.we-online.com/redexpert/spec/885012006086?ad; Manufacturer Part Number: 885012006086; Operating Temperature Min: -55°C; ComponentLink1Description: Website Link; Match Code: WCAP-CSGP; Component Type: Standard; Category: Multilayer Ceramic Chip Capacitors; Source: WCAP-CSGP.SchLib; Length: 1.6mm; Case/Package: 0603; Mount: Surface Mount; ComponentLink1URL: https://www.we-online.com/redexpert/article/885012006086?ad; Width: 0.8mm; Ceramic Type: NP0; Operating Temperature Max: 125°C; Pins: 2; Design Item ID: 885012006086; ComponentLink2Description: Datasheet Link
C23 C28 C33 = CMP-001-00055-1: Ceramic Capacitor, Multilayer, Ceramic, 25V, 10% +Tol, 10% -Tol, X5R, 15% TC, 10uF, Surface Mount, 0805; Min Operating Temperature: -55°C; Pins: 2; Case/Package: 0805; RoHS Compliant: Yes; Mounting Technology: Surface Mount; Capacitor Type: Ceramic; Max Operating Temperature: 85°C
C24 C27 = CMP-001-00152-1: WCAP-CSGP Multilayer Ceramic Chip Capacitor, General Purpose, size 0603, NP0, 47pF, 25VDC; Manufacturer: Wurth Elektronik; Q Factor: 1000; Capacitance Tolerance: +/-5%; Insulation Resistance: 10GOhm; Technical Reference: NP00603470J025DFCT10000; Rated Voltage (DC): 25V; Operating Temperature Max: 125°C; ComponentLink2Description: Datasheet Link; Packaging: Tape and Reel; Ceramic Type: NP0; Height: 0.8mm; Mount: Surface Mount; Pins: 2; Source: WCAP-CSGP.SchLib; Case/Package: 0603; Component Type: Standard; Match Code: WCAP-CSGP; Length: 1.6mm; ComponentLink1Description: Website Link; Width: 0.8mm; Operating Temperature Min: -55°C; ComponentLink2URL: https://www.we-online.com/redexpert/spec/885012006036?ad; Category: Multilayer Ceramic Chip Capacitors; ComponentLink1URL: https://www.we-online.com/redexpert/article/885012006036?ad; Design Item ID: 885012006036; Manufacturer Part Number: 885012006036
C25 C26 = CMP-001-00642-1: as C2 on sheet MCU; Component Type: Standard; Width: 0.8mm; Ceramic Type: X7R; ComponentLink1Description: Website Link; ComponentLink1URL: https://www.we-online.com/redexpert/article/885012206052?ad; Height: 0.8mm; Manufacturer Part Number: 885012206052; Match Code: WCAP-CSGP; Source: WCAP-CSGP.SchLib; Case/Package: 0603; Operating Temperature Min: -55°C; ComponentLink2Description: Datasheet Link; Design Item ID: 885012206052; ComponentLink2URL: https://www.we-online.com/redexpert/spec/885012206052?ad; Category: Multilayer Ceramic Chip Capacitors; Packaging: Tape and Reel; Pins: 2; Length: 1.6mm; Operating Temperature Max: 125°C; Mount: Surface Mount
C29 = CMP-001-00173-1: WCAP-CSGP Multilayer Ceramic Chip Capacitor, General Purpose, size 0603, NP0, 100pF, 50VDC; Manufacturer: Wurth Elektronik; Technical Reference: NP00603101J050DFCT10000; Insulation Resistance: 10GOhm; Q Factor: 1000; Capacitance Tolerance: +/-5%; Rated Voltage (DC): 50V; Component Type: Standard; Design Item ID: 885012006057; ComponentLink1Description: Website Link; ComponentLink1URL: https://www.we-online.com/redexpert/article/885012006057?ad; Case/Package: 0603; Mount: Surface Mount; Width: 0.8mm; ComponentLink2URL: https://www.we-online.com/redexpert/spec/885012006057?ad; Pins: 2; Height: 0.8mm; ComponentLink2Description: Datasheet Link; Ceramic Type: NP0; Length: 1.6mm; Manufacturer Part Number: 885012006057; Operating Temperature Max: 125°C; Match Code: WCAP-CSGP; Category: Multilayer Ceramic Chip Capacitors; Packaging: Tape and Reel; Source: WCAP-CSGP.SchLib; Operating Temperature Min: -55°C
C30 = CMP-001-00661-1: Multilayer Ceramic Chip Capacitor, General Purpose, size 0603, X7R, 0.8pF, 50VDC, Tol=0.1pF; Manufacturer: TAIYO YUDEN; Manufacturer Part Number: MBASU063SCK0R8BFNA01; ComponentLink2Description: Datasheet Link; ComponentLink1URL: https://www.we-online.com/redexpert/article/885012206071?ad; ComponentLink2URL: https://www.we-online.com/redexpert/spec/885012206071?ad; ComponentLink1Description: Website Link
C31 C32 = CMP-001-00661-1: Multilayer Ceramic Chip Capacitor, General Purpose, size 0603, X7R, 1.2pF, 50VDC, Tol=0.1pF; Manufacturer: KYOCERA AVX; Manufacturer Part NUmber: 06035A1R2B4T2A; ComponentLink2Description: Datasheet Link; ComponentLink1URL: https://www.we-online.com/redexpert/article/885012206071?ad; ComponentLink2URL: https://www.we-online.com/redexpert/spec/885012206071?ad; ComponentLink1Description: Website Link
C34 = CMP-001-00440-1: as C9 on sheet MCU; ComponentLink2URL: https://www.we-online.com/redexpert/spec/885012106012?ad; Height: 0.8mm; Packaging: Tape and Reel; Case/Package: 0603; Manufacturer Part Number: 885012106012; Component Type: Standard; Width: 0.8mm; Match Code: WCAP-CSGP; Mount: Surface Mount; Ceramic Type: X5R; Operating Temperature Max: 85°C; ComponentLink1Description: Website Link; Length: 1.6mm; ComponentLink1URL: https://www.we-online.com/redexpert/article/885012106012?ad; ComponentLink2Description: Datasheet Link; Category: Multilayer Ceramic Chip Capacitors; Source: WCAP-CSGP.SchLib; Operating Temperature Min: -55°C; Pins: 2; Design Item ID: 885012106012
D9 = CMP-004-00453-1: WL-SMCW Mono-color Chip LED Waterclear, SMT, size 0805, Red, 2V, 140°; Manufacturer: Wurth Elektronik; Luminous Intensity: 150mcd; Peak Wavelength: 630nm; Chip Technology: AlInGaP; Dominant Wavelength: 625nm; ComponentLink2URL: https://www.we-online.com/redexpert/spec/150080RS75000?ad; Case/Package: 0805; Emitting Color: Red; Operating Temperature Max: 85°C; Match Code: WL-SMCW; Length: 2mm; ComponentLink1URL: https://www.we-online.com/redexpert/article/150080RS75000?ad; Mount: Surface Mount; Pins: 2; Manufacturer Part Number: 150080RS75000; Width: 1.25mm; Source: WL-SMCW.SchLib; ComponentLink1Description: Website Link; Component Type: Standard; Design Item ID: 150080RS75000; ComponentLink2Description: Datasheet Link; Height: 0.7mm; Operating Temperature Min: -40°C; Forward Voltage: 2V; Category: Signal LEDs; Packaging: Tape and Reel; Viewing Angle: 140°
J1 = CMP-03913-97004421-2: 60311002114501 Rf Coax Conn, Sma R/A Jack, 50 Ohm, Pcb Rohs Compliant: Yes; Insulation Resistance: 5GΩ; Insertion Loss (dB): 0.14dB; Impedance: 50Ω; Insulation Material: PTFE; Orientation: Right Angle; Min Operating Temperature: -65°C; Max Operating Temperature: 165°C; NexarPartId: 97004421; Connector Type: SMA
L1 = CMP-006-00671-1: WE-LHCA Low Profile High Current Inductor, SMT, size 7030, 15uH, 3A; Manufacturer: Wurth Elektronik; DC Resistance: 96mOhm; Saturation Current: 4.8A; Component Type: Standard; Design Item ID: 784373460150; ComponentLink2URL: https://www.we-online.com/redexpert/spec/784373460150?ad; ComponentLink1Description: Website Link; Manufacturer Part Number: 784373460150; Category: Power Inductors; Source: WE-LHCA.SchLib; Performance Rated Current: 3A; Packaging: Tape and Reel; ComponentLink2Description: Datasheet Link; Length: 6.95mm; ComponentLink1URL: https://www.we-online.com/redexpert/article/784373460150?ad; Width: 6.6mm; Match Code: WE-LHCA; Height: 2.8mm; Operating Temperature Max: 155°C; Operating Temperature Min: -55°C; Case/Package: 7030; Mount: Surface Mount; Pins: 2
L2 = CMP-03913-65277807-1: 744761056A Wirewound Inductor, 5.6Nh, 0.7A, 0603 Rohs Compliant: Yes; Current Rating: 700mA; Width: 1.05mm; Height: 1.05mm; Length: 1.6mm; Inductance: 5.6nH; Max Operating Temperature: 125°C; Min Operating Temperature: -40°C; RoHS: Compliant; Ambient Temperature Range High: 110°C; NexarPartId: 65277807; Ambient Temperature Range Low: -40°C
L3 = CMP-03913-22865515-1: 744761016A WE-KI SMT Wire Wound Ceramic Inductor; Q Factor: 40; Self Resonant Frequency: 12.5GHz; DC Resistance (DCR): 30mΩ; Inductance Tolerance: 5%; Max DC Current: 700mA; Case/Package: 0603; Packaging: Cut Tape; Width: 1.05mm; Length: 1.6mm; RoHS: Compliant; REACH SVHC: Unknown; Min Operating Temperature: -40°C; NexarPartId: 22865515; Mount: Surface Mount; Inductance: 1.6nH; Resistance: 30mΩ; Ambient Temperature Range Low: -40°C; Number of Pins: 2; Height: 1.05mm; Case Code (Metric): 1608; Current Rating: 700mA; Core Material: Ceramic; Case Code (Imperial): 0603; Max Operating Temperature: 125°C; Ambient Temperature Range High: 110°C
L4 = CMP-06042-001485-1: Wire Wound RF Inductor 3nH ±0.2nH 670mA 0.17Ω 0603 (1608); Shielding: Unshielded; Core Material: Non-Magnetic; DC Resistance (DCR): 170mR; Self Resonant Frequency: 15GHz; Test Frequency: 100MHz; Q Factor: 13; Packaging: Tape and Reel; Case Code (Imperial): 0603; Case Code (Metric): 1608; Length: 0.065inch; Min Operating Temperature: -55°C; Height - Seated (Max): 0.039inch; Current Rating: 670mA; Case/Package: 0603; Resistor Type: Wirewound; Weight: 7.1E-05oz; Max Operating Temperature: 125°C; Max DC Current: 670mA; Package Quantity: 4000; Inductance: 3nH; Width: 0.99mm; Mount: Surface Mount; Height: 0.9mm; Termination: SMD/SMT
L5 = CMP-06042-015805-1: Wire Wound RF Inductor 2.4nH ±0.2nH 2400mA 0.026Ω 0603 (1608); Self Resonant Frequency: 15GHz; DC Resistance (DCR): 26mR; Shielding: Unshielded; Current Rating: 2.4A; Test Frequency: 100MHz; Height - Seated (Max): 0.039inch; Mount: Surface Mount; Min Operating Temperature: -55°C; Inductance: 2.4nH; Width: 0.035inch; Length: 0.065inch; Packaging: Tape and Reel; Package Quantity: 4000; Case/Package: 0603; Max Operating Temperature: 125°C; Resistor Type: Wirewound
R9 R13 R14 = CMP-009-00324-1: WRIS-RSKS Thick Film Resistor, size 0603, 100mW; Manufacturer: Wurth Elektronik; Manufacturer Part Number: 560112116001; Height: 0.45mm; Case/Package: 0603; ComponentLink1Description: Website Link; Operating Temperature Min: -55°C; Mount: Surface Mount; ComponentLink1URL: https://www.we-online.com/redexpert/article/560112116001?ad; ComponentLink2URL: https://www.we-online.com/redexpert/spec/560112116001?ad; Packaging: Tape and Reel; Width: 0.8mm; Operating Temperature Max: 155°C; Source: WRIS-RSKS.SchLib; Category: Thick Film Resistors; Component Type: Standard; Rated Power: 100mW; ComponentLink2Description: Datasheet Link; Length: 1.6mm; Design Item ID: 560112116001; Pins: 2; Match Code: WRIS-RSKS
R10 = CMP-009-00337-1: as R3 on sheet MCU; Mount: Surface Mount; Rated Power: 100mW; Packaging: Tape and Reel; Case/Package: 0603; ComponentLink1URL: https://www.we-online.com/redexpert/article/560112116014?ad; Height: 0.45mm; Manufacturer Part Number: 560112116014; ComponentLink1Description: Website Link; ComponentLink2URL: https://www.we-online.com/redexpert/spec/560112116014?ad; Source: WRIS-RSKS.SchLib; Operating Temperature Min: -55°C; Width: 0.8mm; Match Code: WRIS-RSKS; Design Item ID: 560112116014; ComponentLink2Description: Datasheet Link; Category: Thick Film Resistors; Operating Temperature Max: 155°C; Component Type: Standard; Length: 1.6mm; Pins: 2
R11 R12 = CMP-009-00449-1: WRIS-RSKS Thick Film Resistor, size 0603, 220Ohm, 100mW; Manufacturer: Wurth Elektronik; Temperature Coefficient of Resistance Max: 100ppm/°C; Limiting Element Voltage: 75V; Temperature Coefficient of Resistance Min: -100ppm/°C; Resistance Tolerance: +/-1%; ComponentLink2URL: https://www.we-online.com/redexpert/spec/560112116126?ad; Rated Power: 100mW; Source: WRIS-RSKS.SchLib; Packaging: Tape and Reel; Height: 0.45mm; Manufacturer Part Number: 560112116126; ComponentLink1URL: https://www.we-online.com/redexpert/article/560112116126?ad; Case/Package: 0603; Component Type: Standard; Operating Temperature Min: -55°C; Match Code: WRIS-RSKS; Length: 1.6mm; Category: Thick Film Resistors; Mount: Surface Mount; Width: 0.8mm; Design Item ID: 560112116126; ComponentLink2Description: Datasheet Link; Pins: 2; ComponentLink1Description: Website Link; Operating Temperature Max: 155°C
U2 = CMP-00025-00000-6: Telecom Circuit; RoHS Compliant: Yes
U3 U4 = CMP-2000-05298-1: IC RF Switch SPDT, 50 Ohm, 6-Pin SC70, RoHS, Tape and Reel; Manufacturer: Peregrine Semiconductor; P1dB: 29dBm(typ)IP1dB; Topology: Reflective; Frequency - Upper: 3GHz; Insertion Loss @ Frequency: 0.5dB@2GHz; IIP3: 55dBm(typ); Voltage - Supply: 1.8V~3.3V; Other Names: 1046-1011-24259-63-ND425963PE4259PE4259SCBC-ZPE4259SCBC-Z-ND; Isolation @ Frequency: 20dB@2GHz(typ); Frequency - Lower: 10MHz; Online Catalog: PE4259; Impedance: 50Ohm; RF Type: GeneralPurpose; Series: UltraCMOS; Manufacturer URL: http://www.psemi.com/; Package Description: 6-Pin Small Outline Transistor, Body 2.05 x 1.25 mm, Pitch 0.65 mm; Family: RFSwitches; Packaging: Tape&Reel(TR); Features: Single/DualLineControl; Package / Case: 6-TSSOP,SC-88,SOT-363; Operating Temperature: -40degC~85degC; Circuit: SPDT; Supplier Device Package: SC-70-6; Standard Package: 3,000; Datasheet URL: https://datasheet.ciiva.com/15100/getdatasheetpartid-685660-15100501.pdf; Category: RF/IFandRFID; Datasheet Version: Jan-11; Package Reference: SC-70-6
U5 = CMP-00025-00005-4: Amplificador de RF High Gain LNA
Y2 = CMP-003-00000-1: Crystals 52.000 MHz 12 pF ECS-33B +/-7/15 ppm -40 - +85C +/-1 ppm Aging 3225 4-SMD RoHS